# Altium project placa motores.PrjPcb
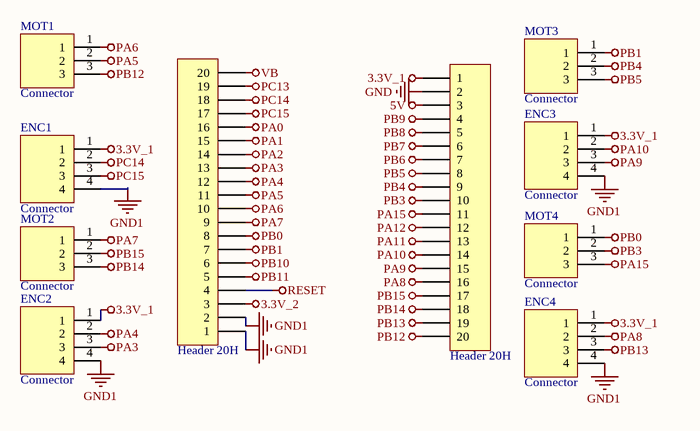
[diagram p0: placaMotoresSch.SchDoc]
1 sheet, 10 parts. Net scope: global (net labels, ports and power ports of the same name join across sheets).
Board file: placaMotoresPCB.PcbDoc

## Sheet placaMotoresSch.SchDoc
size A4

### Parts
(Parts that share a designator on the sheet are numbered #1, #2 ... from top to bottom, then left to right.)
ENC1  Connector  [1x4x2.54 Pin Header TH V]
ENC2  Connector  [1x4x2.54 Pin Header TH V]
ENC3  Connector  [1x4x2.54 Pin Header TH V]
ENC4  Connector  [1x4x2.54 Pin Header TH V]
MOT1  Connector  [1x3x2.54 Pin Header TH V]
MOT2  Connector  [1x3x2.54 Pin Header TH V]
MOT3  Connector  [1x3x2.54 Pin Header TH V]
MOT4  Connector  [1x3x2.54 Pin Header TH V]
P?#1  Header 20H  [HDR1X20H]
P?#2  Header 20H  [HDR1X20H]

### Nets
3.3V_1: ENC1.1 ENC2.1 ENC3.1 ENC4.1 P?#1.1
3.3V_2: P?#2.3
5V: P?#1.3
GND: P?#1.2
GND1: ENC1.4 ENC2.4 ENC3.4 ENC4.4 P?#2.1 P?#2.2
PA0: P?#2.16
PA1: P?#2.15
PA2: P?#2.14
PA3: ENC2.3 P?#2.13
PA4: ENC2.2 P?#2.12
PA5: MOT1.2 P?#2.11
PA6: MOT1.1 P?#2.10
PA7: MOT2.1 P?#2.9
PA8: ENC4.2 P?#1.16
PA9: ENC3.3 P?#1.15
PA10: ENC3.2 P?#1.14
PA11: P?#1.13
PA12: P?#1.12
PA15: MOT4.3 P?#1.11
PB0: MOT4.1 P?#2.8
PB1: MOT3.1 P?#2.7
PB3: MOT4.2 P?#1.10
PB4: MOT3.2 P?#1.9
PB5: MOT3.3 P?#1.8
PB6: P?#1.7
PB7: P?#1.6
PB8: P?#1.5
PB9: P?#1.4
PB10: P?#2.6
PB11: P?#2.5
PB12: MOT1.3 P?#1.20
PB13: ENC4.3 P?#1.19
PB14: MOT2.3 P?#1.18
PB15: MOT2.2 P?#1.17
PC13: P?#2.19
PC14: ENC1.2 P?#2.18
PC15: ENC1.3 P?#2.17
RESET: P?#2.4
VB: P?#2.20

### Library data of the parts
ENC1-ENC4 = Header 1x4
MOT1-MOT4 = Header 1x3
P?#1 P?#2 = Header 20H: Header, 20-Pin, Right Angle; LatestRevisionDate: 17-Jul-2002; LatestRevisionNote: Re-released for DXP Platform.; Publisher: Altium Limited